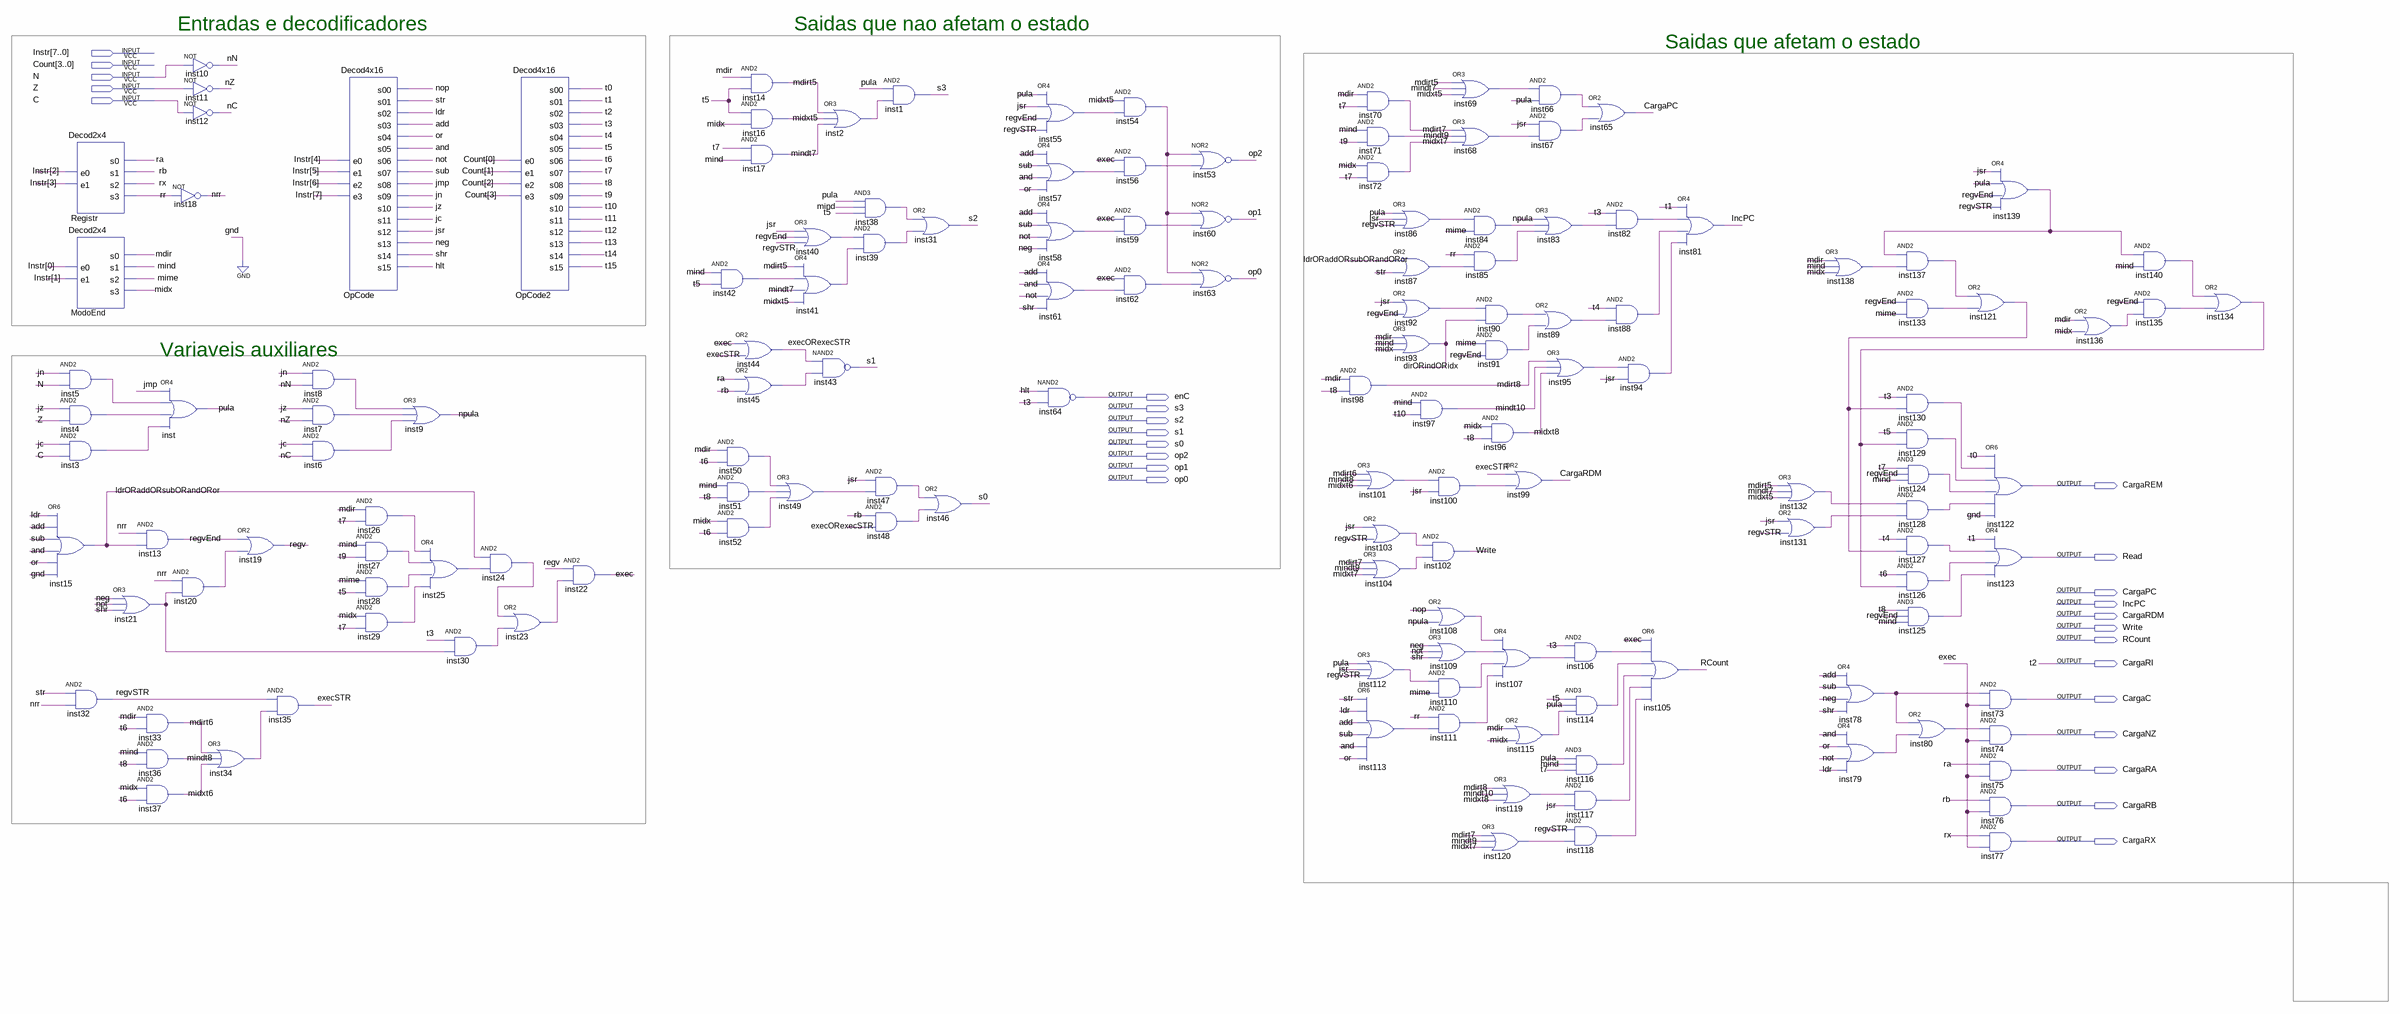
[diagram p0: schematic sheet]
// Quartus schematic Controle.bdf as structural Verilog: 145 symbols, 26 pins
module Controle (
  input  [7:0] Instr,
  input  [3:0] Count,
  input  N,
  input  Z,
  input  C,
  output enC,
  output s3,
  output s2,
  output s1,
  output s0,
  output op2,
  output op1,
  output op0,
  output CargaREM,
  output Read,
  output CargaPC,
  output IncPC,
  output CargaRDM,
  output Write,
  output RCount,
  output CargaRI,
  output CargaC,
  output CargaNZ,
  output CargaRA,
  output CargaRB,
  output CargaRX
);

  wire add, \and , dirORindORidx, exec, execORexecSTR, execSTR, hlt, inst2_out, inst3_out, inst4_out,
       inst5_out, inst6_out, inst7_out, inst8_out, inst20_out, inst21_out, inst23_out, inst24_out,
       inst25_out, inst26_out, inst27_out, inst28_out, inst29_out, inst30_out, inst34_out, inst38_out,
       inst39_out, inst40_out, inst41_out, inst42_out, inst45_out, inst47_out, inst48_out, inst49_out,
       inst50_out, inst51_out, inst52_out, inst54_out, inst55_out, inst56_out, inst57_out, inst58_out,
       inst59_out, inst61_out, inst62_out, inst66_out, inst67_out, inst68_out, inst69_out, inst78_out,
       inst79_out, inst80_out, inst82_out, inst83_out, inst84_out, inst85_out, inst86_out, inst87_out,
       inst88_out, inst89_out, inst90_out, inst91_out, inst92_out, inst94_out, inst95_out, inst100_out,
       inst101_out, inst103_out, inst104_out, inst106_out, inst107_out, inst108_out, inst109_out,
       inst110_out, inst111_out, inst112_out, inst113_out, inst114_out, inst115_out, inst116_out,
       inst117_out, inst118_out, inst119_out, inst120_out, inst121_out, inst124_out, inst125_out,
       inst126_out, inst127_out, inst128_out, inst129_out, inst130_out, inst131_out, inst132_out,
       inst133_out, inst134_out, inst135_out, inst136_out, inst137_out, inst138_out, inst139_out,
       inst140_out, jc, jmp, jn, jsr, jz, ldr, ldrORaddORsubORandORor, mdir, mdirt5, mdirt6, mdirt7, mdirt8,
       midx, midxt5, midxt6, midxt7, midxt8, mime, mind, mindt7, mindt8, mindt9, mindt10, nC, neg, nN, nop,
       \not , npula, nrr, nZ, \or , pula, ra, rb, regv, regvEnd, regvSTR, rr, rx, shr, str, sub, t0, t1, t3,
       t4, t5, t6, t7, t8, t9, t10, t11, t12, t13, t14, t15;

  Decod2x4 Registr (.e0(Instr[2]), .e1(Instr[3]), .s0(ra), .s1(rb), .s2(rx), .s3(rr));
  Decod2x4 ModoEnd (.e0(Instr[0]), .e1(Instr[1]), .s0(mdir), .s1(mind), .s2(mime), .s3(midx));
  and inst5 (inst5_out, jn, N);
  and inst4 (inst4_out, jz, Z);
  and inst3 (inst3_out, jc, C);
  or inst15 (ldrORaddORsubORandORor, ldr, add, sub, \and , \or , 1'b0);
  and inst32 (regvSTR, str, nrr);
  or inst21 (inst21_out, neg, \not , shr);
  or inst (pula, jmp, inst5_out, inst4_out, inst3_out);
  and inst13 (regvEnd, nrr, ldrORaddORsubORandORor);
  and inst33 (mdirt6, mdir, t6);
  and inst36 (mindt8, mind, t8);
  and inst37 (midxt6, midx, t6);
  not inst10 (nN, N);
  not inst11 (nZ, Z);
  not inst12 (nC, C);
  not inst18 (nrr, rr);
  and inst20 (inst20_out, nrr, inst21_out);
  or inst34 (inst34_out, mdirt6, mindt8, midxt6);
  or inst19 (regv, regvEnd, inst20_out);
  and inst8 (inst8_out, jn, nN);
  and inst7 (inst7_out, jz, nZ);
  and inst6 (inst6_out, jc, nC);
  and inst35 (execSTR, regvSTR, inst34_out);
  Decod4x16 OpCode (
    .e0(Instr[4]), .e1(Instr[5]), .e2(Instr[6]), .e3(Instr[7]), .s00(nop), .s01(str), .s02(ldr), .s03(add),
    .s04(\or ), .s05(\and ), .s06(\not ), .s07(sub), .s08(jmp), .s09(jn), .s10(jz), .s11(jc), .s12(jsr),
    .s13(neg), .s14(shr), .s15(hlt));
  and inst26 (inst26_out, mdir, t7);
  and inst27 (inst27_out, mind, t9);
  and inst28 (inst28_out, mime, t5);
  and inst29 (inst29_out, midx, t7);
  or inst9 (npula, inst8_out, inst7_out, inst6_out);
  or inst25 (inst25_out, inst26_out, inst27_out, inst28_out, inst29_out);
  and inst30 (inst30_out, t3, inst21_out);
  and inst24 (inst24_out, ldrORaddORsubORandORor, inst25_out);
  Decod4x16 OpCode2 (
    .e0(Count[0]), .e1(Count[1]), .e2(Count[2]), .e3(Count[3]), .s00(t0), .s01(t1), .s02(CargaRI), .s03(t3),
    .s04(t4), .s05(t5), .s06(t6), .s07(t7), .s08(t8), .s09(t9), .s10(t10), .s11(t11), .s12(t12), .s13(t13),
    .s14(t14), .s15(t15));
  or inst23 (inst23_out, inst24_out, inst30_out);
  and inst22 (exec, regv, inst23_out);
  and inst42 (inst42_out, mind, t5);
  and inst50 (inst50_out, mdir, t6);
  and inst51 (inst51_out, mind, t8);
  and inst52 (inst52_out, midx, t6);
  and inst14 (mdirt5, mdir, t5);
  and inst16 (midxt5, t5, midx);
  and inst17 (mindt7, t7, mind);
  or inst44 (execORexecSTR, exec, execSTR);
  or inst45 (inst45_out, ra, rb);
  or inst49 (inst49_out, inst50_out, inst51_out, inst52_out);
  or inst2 (inst2_out, mdirt5, midxt5, mindt7);
  or inst40 (inst40_out, jsr, regvEnd, regvSTR);
  or inst41 (inst41_out, mdirt5, inst42_out, mindt7, midxt5);
  nand inst43 (s1, execORexecSTR, inst45_out);
  and inst38 (inst38_out, pula, mind, t5);
  and inst39 (inst39_out, inst40_out, inst41_out);
  and inst47 (inst47_out, jsr, inst49_out);
  and inst48 (inst48_out, rb, execORexecSTR);
  and inst1 (s3, pula, inst2_out);
  or inst31 (s2, inst38_out, inst39_out);
  or inst46 (s0, inst47_out, inst48_out);
  or inst55 (inst55_out, pula, jsr, regvEnd, regvSTR);
  or inst57 (inst57_out, add, sub, \and , \or );
  or inst58 (inst58_out, add, sub, \not , neg);
  or inst61 (inst61_out, add, \and , \not , shr);
  nand inst64 (enC, hlt, t3);
  and inst54 (inst54_out, midxt5, inst55_out);
  and inst56 (inst56_out, exec, inst57_out);
  and inst59 (inst59_out, exec, inst58_out);
  and inst62 (inst62_out, exec, inst61_out);
  nor inst53 (op2, inst54_out, inst56_out);
  nor inst60 (op1, inst54_out, inst59_out);
  nor inst63 (op0, inst54_out, inst62_out);
  and inst98 (mdirt8, mdir, t8);
  and inst70 (mdirt7, mdir, t7);
  and inst71 (mindt9, mind, t9);
  and inst72 (midxt7, midx, t7);
  or inst86 (inst86_out, pula, jsr, regvSTR);
  or inst87 (inst87_out, ldrORaddORsubORandORor, str);
  or inst92 (inst92_out, jsr, regvEnd);
  or inst93 (dirORindORidx, mdir, mind, midx);
  or inst101 (inst101_out, mdirt6, mindt8, midxt6);
  or inst103 (inst103_out, jsr, regvSTR);
  or inst104 (inst104_out, mdirt7, mindt9, midxt7);
  or inst112 (inst112_out, pula, jsr, regvSTR);
  or inst113 (inst113_out, str, ldr, add, sub, \and , \or );
  and inst97 (mindt10, mind, t10);
  and inst100 (inst100_out, inst101_out, jsr);
  and inst102 (Write, inst103_out, inst104_out);
  or inst108 (inst108_out, nop, npula);
  or inst109 (inst109_out, neg, \not , shr);
  and inst110 (inst110_out, inst112_out, mime);
  and inst111 (inst111_out, rr, inst113_out);
  or inst69 (inst69_out, mdirt5, mindt7, midxt5);
  or inst68 (inst68_out, mdirt7, mindt9, midxt7);
  and inst84 (inst84_out, inst86_out, mime);
  and inst85 (inst85_out, rr, inst87_out);
  and inst90 (inst90_out, inst92_out, dirORindORidx);
  and inst91 (inst91_out, mime, regvEnd);
  and inst96 (midxt8, midx, t8);
  or inst120 (inst120_out, mdirt7, mindt9, midxt7);
  and inst66 (inst66_out, inst69_out, pula);
  and inst67 (inst67_out, jsr, inst68_out);
  or inst83 (inst83_out, npula, inst84_out, inst85_out);
  or inst89 (inst89_out, inst90_out, inst91_out);
  or inst99 (CargaRDM, execSTR, inst100_out);
  or inst107 (inst107_out, inst108_out, inst109_out, inst110_out, inst111_out);
  or inst115 (inst115_out, mdir, midx);
  or inst119 (inst119_out, mdirt8, mindt10, midxt8);
  or inst95 (inst95_out, mdirt8, mindt10, midxt8);
  and inst106 (inst106_out, t3, inst107_out);
  and inst114 (inst114_out, t5, pula, inst115_out);
  and inst116 (inst116_out, pula, mind, t7);
  and inst117 (inst117_out, inst119_out, jsr);
  and inst118 (inst118_out, regvSTR, inst120_out);
  or inst65 (CargaPC, inst66_out, inst67_out);
  and inst82 (inst82_out, t3, inst83_out);
  and inst88 (inst88_out, t4, inst89_out);
  and inst94 (inst94_out, inst95_out, jsr);
  or inst81 (IncPC, t1, inst82_out, inst88_out, inst94_out);
  or inst105 (RCount, exec, inst106_out, inst114_out, inst116_out, inst117_out, inst118_out);
  or inst132 (inst132_out, mdirt5, mindt7, midxt5);
  or inst131 (inst131_out, jsr, regvSTR);
  or inst138 (inst138_out, mdir, mind, midx);
  or inst78 (inst78_out, add, sub, neg, shr);
  or inst79 (inst79_out, \and , \or , \not , ldr);
  and inst137 (inst137_out, inst139_out, inst138_out);
  and inst133 (inst133_out, regvEnd, mime);
  and inst130 (inst130_out, t3, inst121_out);
  and inst129 (inst129_out, t5, inst134_out);
  and inst124 (inst124_out, t7, regvEnd, mind);
  and inst128 (inst128_out, inst132_out, inst131_out);
  and inst127 (inst127_out, t4, inst121_out);
  and inst126 (inst126_out, t6, inst134_out);
  and inst125 (inst125_out, t8, regvEnd, mind);
  or inst80 (inst80_out, inst78_out, inst79_out);
  or inst139 (inst139_out, jsr, pula, regvEnd, regvSTR);
  or inst121 (inst121_out, inst137_out, inst133_out);
  or inst122 (CargaREM, t0, inst130_out, inst129_out, inst124_out, inst128_out, 1'b0);
  or inst123 (Read, t1, inst127_out, inst126_out, inst125_out);
  and inst73 (CargaC, inst78_out, exec);
  and inst74 (CargaNZ, inst80_out, exec);
  and inst75 (CargaRA, ra, exec);
  and inst76 (CargaRB, rb, exec);
  and inst77 (CargaRX, rx, exec);
  or inst136 (inst136_out, mdir, midx);
  and inst140 (inst140_out, inst139_out, mind);
  and inst135 (inst135_out, regvEnd, inst136_out);
  or inst134 (inst134_out, inst140_out, inst135_out);

  // Other names for the same wires on the sheet: t2 = CargaRI

  // Notes on the sheet:
  //   Entradas e decodificadores
  //   Saidas que nao afetam o estado
  //   Saidas que afetam o estado
  //   Variaveis auxiliares
endmodule
